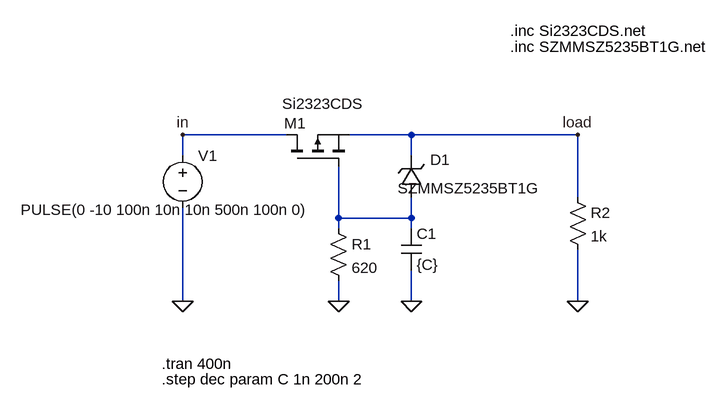
[diagram p0: schematic Reverse_protection.asc]
Reverse_protection.asc, the LTspice schematic file:
Version 4
SHEET 1 1500 2624
WIRE -256 192 -416 192
WIRE -64 192 -160 192
WIRE 192 192 -64 192
WIRE -416 224 -416 192
WIRE -64 224 -64 192
WIRE 192 288 192 192
WIRE -176 320 -176 240
WIRE -64 320 -64 288
WIRE -64 320 -176 320
WIRE -176 336 -176 320
WIRE -64 336 -64 320
WIRE -416 448 -416 304
WIRE -176 448 -176 416
WIRE -64 448 -64 400
WIRE 192 448 192 368
FLAG -64 448 0
FLAG -176 448 0
FLAG -416 448 0
FLAG 192 448 0
FLAG 192 192 load
FLAG -416 192 in
SYMBOL zener -48 288 R180
WINDOW 0 -44 58 Left 2
WINDOW 3 -182 14 Left 2
SYMATTR InstName D1
SYMATTR Value SZMMSZ5235BT1G
SYMATTR Prefix X
SYMBOL voltage -416 208 R0
WINDOW 3 -249 99 Left 2
WINDOW 123 0 0 Left 0
WINDOW 39 0 0 Left 0
SYMATTR Value PULSE(0 -10 100n 10n 10n 500n 100n 0)
SYMATTR InstName V1
SYMBOL res -192 320 R0
SYMATTR InstName R1
SYMATTR Value 620
SYMBOL cap -80 336 R0
SYMATTR InstName C1
SYMATTR Value {C}
SYMBOL res 176 272 R0
SYMATTR InstName R2
SYMATTR Value 1k
SYMBOL pmos -256 240 R270
WINDOW 0 66 -4 VRight 2
WINDOW 3 96 -7 VRight 2
SYMATTR InstName M1
SYMATTR Value Si2323CDS
SYMATTR Prefix X
TEXT -448 544 Left 2 !.tran 400n
TEXT -448 568 Left 2 !.step dec param C 1n 200n 2
TEXT 88 32 Left 2 !.inc Si2323CDS.net
TEXT 88 56 Left 2 !.inc SZMMSZ5235BT1G.net

The netlist it stands for:
* Reverse_protection.asc
XD1 N001 load SZMMSZ5235BT1G  ; pins + -
V1 in 0 PULSE(0 -10 100n 10n 10n 500n 100n 0)
R1 N001 0 620
C1 N001 0 {C}
R2 load 0 1k
XM1 in N001 load Si2323CDS  ; pins D G S
.tran 400n
.step dec param C 1n 200n 2
.inc Si2323CDS.net
.inc SZMMSZ5235BT1G.net
.backanno
.end